# Altium project LED_Panel.PrjPCB (part 2 of 2)

## Sheet LEDs.SchDoc
size A3
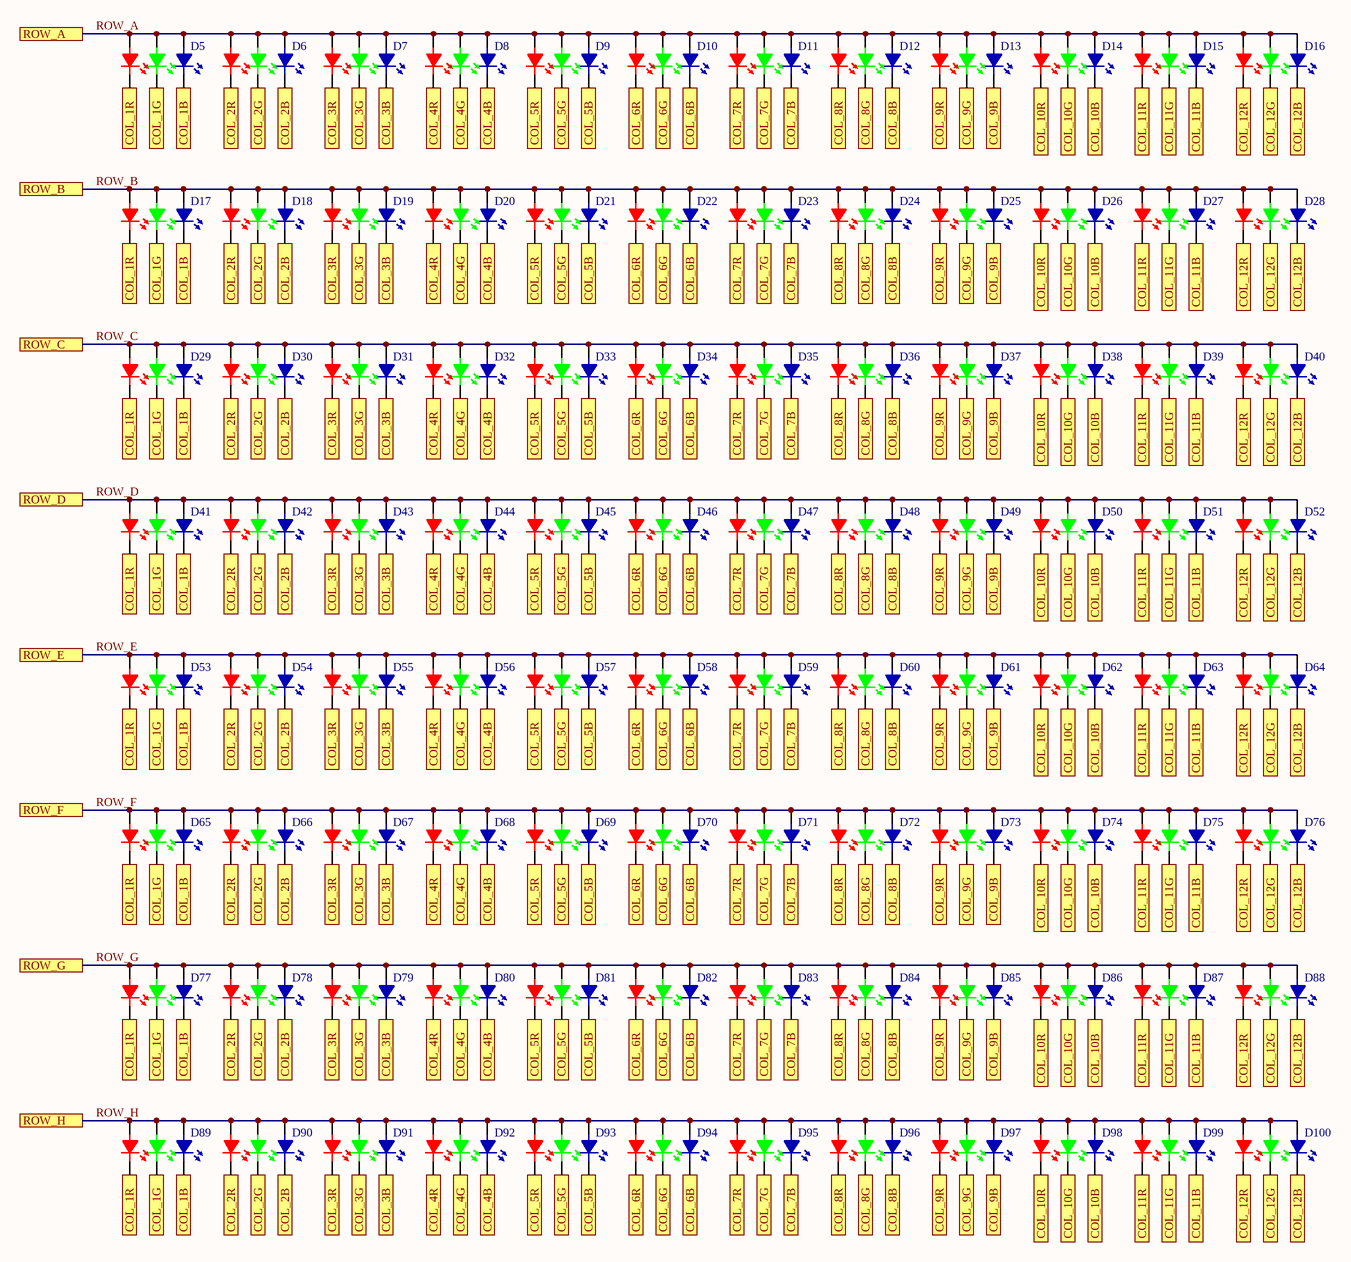
[diagram p2: LEDs.SchDoc]

### Parts
D5  CLX6E-FKC-CH1M1D1BB7C3D3  [LED_CLX6E]  (value not drawn)
D6  CLX6E-FKC-CH1M1D1BB7C3D3  [LED_CLX6E]  (value not drawn)
D7  CLX6E-FKC-CH1M1D1BB7C3D3  [LED_CLX6E]  (value not drawn)
D8  CLX6E-FKC-CH1M1D1BB7C3D3  [LED_CLX6E]  (value not drawn)
D9  CLX6E-FKC-CH1M1D1BB7C3D3  [LED_CLX6E]  (value not drawn)
D10  CLX6E-FKC-CH1M1D1BB7C3D3  [LED_CLX6E]  (value not drawn)
D11  CLX6E-FKC-CH1M1D1BB7C3D3  [LED_CLX6E]  (value not drawn)
D12  CLX6E-FKC-CH1M1D1BB7C3D3  [LED_CLX6E]  (value not drawn)
D13  CLX6E-FKC-CH1M1D1BB7C3D3  [LED_CLX6E]  (value not drawn)
D14  CLX6E-FKC-CH1M1D1BB7C3D3  [LED_CLX6E]  (value not drawn)
D15  CLX6E-FKC-CH1M1D1BB7C3D3  [LED_CLX6E]  (value not drawn)
D16  CLX6E-FKC-CH1M1D1BB7C3D3  [LED_CLX6E]  (value not drawn)
D17  CLX6E-FKC-CH1M1D1BB7C3D3  [LED_CLX6E]  (value not drawn)
D18  CLX6E-FKC-CH1M1D1BB7C3D3  [LED_CLX6E]  (value not drawn)
D19  CLX6E-FKC-CH1M1D1BB7C3D3  [LED_CLX6E]  (value not drawn)
D20  CLX6E-FKC-CH1M1D1BB7C3D3  [LED_CLX6E]  (value not drawn)
D21  CLX6E-FKC-CH1M1D1BB7C3D3  [LED_CLX6E]  (value not drawn)
D22  CLX6E-FKC-CH1M1D1BB7C3D3  [LED_CLX6E]  (value not drawn)
D23  CLX6E-FKC-CH1M1D1BB7C3D3  [LED_CLX6E]  (value not drawn)
D24  CLX6E-FKC-CH1M1D1BB7C3D3  [LED_CLX6E]  (value not drawn)
D25  CLX6E-FKC-CH1M1D1BB7C3D3  [LED_CLX6E]  (value not drawn)
D26  CLX6E-FKC-CH1M1D1BB7C3D3  [LED_CLX6E]  (value not drawn)
D27  CLX6E-FKC-CH1M1D1BB7C3D3  [LED_CLX6E]  (value not drawn)
D28  CLX6E-FKC-CH1M1D1BB7C3D3  [LED_CLX6E]  (value not drawn)
D29  CLX6E-FKC-CH1M1D1BB7C3D3  [LED_CLX6E]  (value not drawn)
D30  CLX6E-FKC-CH1M1D1BB7C3D3  [LED_CLX6E]  (value not drawn)
D31  CLX6E-FKC-CH1M1D1BB7C3D3  [LED_CLX6E]  (value not drawn)
D32  CLX6E-FKC-CH1M1D1BB7C3D3  [LED_CLX6E]  (value not drawn)
D33  CLX6E-FKC-CH1M1D1BB7C3D3  [LED_CLX6E]  (value not drawn)
D34  CLX6E-FKC-CH1M1D1BB7C3D3  [LED_CLX6E]  (value not drawn)
D35  CLX6E-FKC-CH1M1D1BB7C3D3  [LED_CLX6E]  (value not drawn)
D36  CLX6E-FKC-CH1M1D1BB7C3D3  [LED_CLX6E]  (value not drawn)
D37  CLX6E-FKC-CH1M1D1BB7C3D3  [LED_CLX6E]  (value not drawn)
D38  CLX6E-FKC-CH1M1D1BB7C3D3  [LED_CLX6E]  (value not drawn)
D39  CLX6E-FKC-CH1M1D1BB7C3D3  [LED_CLX6E]  (value not drawn)
D40  CLX6E-FKC-CH1M1D1BB7C3D3  [LED_CLX6E]  (value not drawn)
D41  CLX6E-FKC-CH1M1D1BB7C3D3  [LED_CLX6E]  (value not drawn)
D42  CLX6E-FKC-CH1M1D1BB7C3D3  [LED_CLX6E]  (value not drawn)
D43  CLX6E-FKC-CH1M1D1BB7C3D3  [LED_CLX6E]  (value not drawn)
D44  CLX6E-FKC-CH1M1D1BB7C3D3  [LED_CLX6E]  (value not drawn)
D45  CLX6E-FKC-CH1M1D1BB7C3D3  [LED_CLX6E]  (value not drawn)
D46  CLX6E-FKC-CH1M1D1BB7C3D3  [LED_CLX6E]  (value not drawn)
D47  CLX6E-FKC-CH1M1D1BB7C3D3  [LED_CLX6E]  (value not drawn)
D48  CLX6E-FKC-CH1M1D1BB7C3D3  [LED_CLX6E]  (value not drawn)
D49  CLX6E-FKC-CH1M1D1BB7C3D3  [LED_CLX6E]  (value not drawn)
D50  CLX6E-FKC-CH1M1D1BB7C3D3  [LED_CLX6E]  (value not drawn)
D51  CLX6E-FKC-CH1M1D1BB7C3D3  [LED_CLX6E]  (value not drawn)
D52  CLX6E-FKC-CH1M1D1BB7C3D3  [LED_CLX6E]  (value not drawn)
D53  CLX6E-FKC-CH1M1D1BB7C3D3  [LED_CLX6E]  (value not drawn)
D54  CLX6E-FKC-CH1M1D1BB7C3D3  [LED_CLX6E]  (value not drawn)
D55  CLX6E-FKC-CH1M1D1BB7C3D3  [LED_CLX6E]  (value not drawn)
D56  CLX6E-FKC-CH1M1D1BB7C3D3  [LED_CLX6E]  (value not drawn)
D57  CLX6E-FKC-CH1M1D1BB7C3D3  [LED_CLX6E]  (value not drawn)
D58  CLX6E-FKC-CH1M1D1BB7C3D3  [LED_CLX6E]  (value not drawn)
D59  CLX6E-FKC-CH1M1D1BB7C3D3  [LED_CLX6E]  (value not drawn)
D60  CLX6E-FKC-CH1M1D1BB7C3D3  [LED_CLX6E]  (value not drawn)
D61  CLX6E-FKC-CH1M1D1BB7C3D3  [LED_CLX6E]  (value not drawn)
D62  CLX6E-FKC-CH1M1D1BB7C3D3  [LED_CLX6E]  (value not drawn)
D63  CLX6E-FKC-CH1M1D1BB7C3D3  [LED_CLX6E]  (value not drawn)
D64  CLX6E-FKC-CH1M1D1BB7C3D3  [LED_CLX6E]  (value not drawn)
D65  CLX6E-FKC-CH1M1D1BB7C3D3  [LED_CLX6E]  (value not drawn)
D66  CLX6E-FKC-CH1M1D1BB7C3D3  [LED_CLX6E]  (value not drawn)
D67  CLX6E-FKC-CH1M1D1BB7C3D3  [LED_CLX6E]  (value not drawn)
D68  CLX6E-FKC-CH1M1D1BB7C3D3  [LED_CLX6E]  (value not drawn)
D69  CLX6E-FKC-CH1M1D1BB7C3D3  [LED_CLX6E]  (value not drawn)
D70  CLX6E-FKC-CH1M1D1BB7C3D3  [LED_CLX6E]  (value not drawn)
D71  CLX6E-FKC-CH1M1D1BB7C3D3  [LED_CLX6E]  (value not drawn)
D72  CLX6E-FKC-CH1M1D1BB7C3D3  [LED_CLX6E]  (value not drawn)
D73  CLX6E-FKC-CH1M1D1BB7C3D3  [LED_CLX6E]  (value not drawn)
D74  CLX6E-FKC-CH1M1D1BB7C3D3  [LED_CLX6E]  (value not drawn)
D75  CLX6E-FKC-CH1M1D1BB7C3D3  [LED_CLX6E]  (value not drawn)
D76  CLX6E-FKC-CH1M1D1BB7C3D3  [LED_CLX6E]  (value not drawn)
D77  CLX6E-FKC-CH1M1D1BB7C3D3  [LED_CLX6E]  (value not drawn)
D78  CLX6E-FKC-CH1M1D1BB7C3D3  [LED_CLX6E]  (value not drawn)
D79  CLX6E-FKC-CH1M1D1BB7C3D3  [LED_CLX6E]  (value not drawn)
D80  CLX6E-FKC-CH1M1D1BB7C3D3  [LED_CLX6E]  (value not drawn)
D81  CLX6E-FKC-CH1M1D1BB7C3D3  [LED_CLX6E]  (value not drawn)
D82  CLX6E-FKC-CH1M1D1BB7C3D3  [LED_CLX6E]  (value not drawn)
D83  CLX6E-FKC-CH1M1D1BB7C3D3  [LED_CLX6E]  (value not drawn)
D84  CLX6E-FKC-CH1M1D1BB7C3D3  [LED_CLX6E]  (value not drawn)
D85  CLX6E-FKC-CH1M1D1BB7C3D3  [LED_CLX6E]  (value not drawn)
D86  CLX6E-FKC-CH1M1D1BB7C3D3  [LED_CLX6E]  (value not drawn)
D87  CLX6E-FKC-CH1M1D1BB7C3D3  [LED_CLX6E]  (value not drawn)
D88  CLX6E-FKC-CH1M1D1BB7C3D3  [LED_CLX6E]  (value not drawn)
D89  CLX6E-FKC-CH1M1D1BB7C3D3  [LED_CLX6E]  (value not drawn)
D90  CLX6E-FKC-CH1M1D1BB7C3D3  [LED_CLX6E]  (value not drawn)
D91  CLX6E-FKC-CH1M1D1BB7C3D3  [LED_CLX6E]  (value not drawn)
D92  CLX6E-FKC-CH1M1D1BB7C3D3  [LED_CLX6E]  (value not drawn)
D93  CLX6E-FKC-CH1M1D1BB7C3D3  [LED_CLX6E]  (value not drawn)
D94  CLX6E-FKC-CH1M1D1BB7C3D3  [LED_CLX6E]  (value not drawn)
D95  CLX6E-FKC-CH1M1D1BB7C3D3  [LED_CLX6E]  (value not drawn)
D96  CLX6E-FKC-CH1M1D1BB7C3D3  [LED_CLX6E]  (value not drawn)
D97  CLX6E-FKC-CH1M1D1BB7C3D3  [LED_CLX6E]  (value not drawn)
D98  CLX6E-FKC-CH1M1D1BB7C3D3  [LED_CLX6E]  (value not drawn)
D99  CLX6E-FKC-CH1M1D1BB7C3D3  [LED_CLX6E]  (value not drawn)
D100  CLX6E-FKC-CH1M1D1BB7C3D3  [LED_CLX6E]  (value not drawn)

### Ports
COL_1B, COL_1G, COL_1R, COL_2B, COL_2G, COL_2R, COL_3B, COL_3G, COL_3R, COL_4B, COL_4G, COL_4R, COL_5B, COL_5G, COL_5R, COL_6B, COL_6G, COL_6R, COL_7B, COL_7G, COL_7R, COL_8B, COL_8G, COL_8R, COL_9B, COL_9G, COL_9R, COL_10B, COL_10G, COL_10R, COL_11B, COL_11G, COL_11R, COL_12B, COL_12G, COL_12R, ROW_A, ROW_B, ROW_C, ROW_D, ROW_E, ROW_F, ROW_G, ROW_H

### Nets
COL_1B: D5.1 D17.1 D29.1 D41.1 D53.1 D65.1 D77.1 D89.1 ; port COL_1B
COL_1G: D5.2 D17.2 D29.2 D41.2 D53.2 D65.2 D77.2 D89.2 ; port COL_1G
COL_1R: D5.3 D17.3 D29.3 D41.3 D53.3 D65.3 D77.3 D89.3 ; port COL_1R
COL_2B: D6.1 D18.1 D30.1 D42.1 D54.1 D66.1 D78.1 D90.1 ; port COL_2B
COL_2G: D6.2 D18.2 D30.2 D42.2 D54.2 D66.2 D78.2 D90.2 ; port COL_2G
COL_2R: D6.3 D18.3 D30.3 D42.3 D54.3 D66.3 D78.3 D90.3 ; port COL_2R
COL_3B: D7.1 D19.1 D31.1 D43.1 D55.1 D67.1 D79.1 D91.1 ; port COL_3B
COL_3G: D7.2 D19.2 D31.2 D43.2 D55.2 D67.2 D79.2 D91.2 ; port COL_3G
COL_3R: D7.3 D19.3 D31.3 D43.3 D55.3 D67.3 D79.3 D91.3 ; port COL_3R
COL_4B: D8.1 D20.1 D32.1 D44.1 D56.1 D68.1 D80.1 D92.1 ; port COL_4B
COL_4G: D8.2 D20.2 D32.2 D44.2 D56.2 D68.2 D80.2 D92.2 ; port COL_4G
COL_4R: D8.3 D20.3 D32.3 D44.3 D56.3 D68.3 D80.3 D92.3 ; port COL_4R
COL_5B: D9.1 D21.1 D33.1 D45.1 D57.1 D69.1 D81.1 D93.1 ; port COL_5B
COL_5G: D9.2 D21.2 D33.2 D45.2 D57.2 D69.2 D81.2 D93.2 ; port COL_5G
COL_5R: D9.3 D21.3 D33.3 D45.3 D57.3 D69.3 D81.3 D93.3 ; port COL_5R
COL_6B: D10.1 D22.1 D34.1 D46.1 D58.1 D70.1 D82.1 D94.1 ; port COL_6B
COL_6G: D10.2 D22.2 D34.2 D46.2 D58.2 D70.2 D82.2 D94.2 ; port COL_6G
COL_6R: D10.3 D22.3 D34.3 D46.3 D58.3 D70.3 D82.3 D94.3 ; port COL_6R
COL_7B: D11.1 D23.1 D35.1 D47.1 D59.1 D71.1 D83.1 D95.1 ; port COL_7B
COL_7G: D11.2 D23.2 D35.2 D47.2 D59.2 D71.2 D83.2 D95.2 ; port COL_7G
COL_7R: D11.3 D23.3 D35.3 D47.3 D59.3 D71.3 D83.3 D95.3 ; port COL_7R
COL_8B: D12.1 D24.1 D36.1 D48.1 D60.1 D72.1 D84.1 D96.1 ; port COL_8B
COL_8G: D12.2 D24.2 D36.2 D48.2 D60.2 D72.2 D84.2 D96.2 ; port COL_8G
COL_8R: D12.3 D24.3 D36.3 D48.3 D60.3 D72.3 D84.3 D96.3 ; port COL_8R
COL_9B: D13.1 D25.1 D37.1 D49.1 D61.1 D73.1 D85.1 D97.1 ; port COL_9B
COL_9G: D13.2 D25.2 D37.2 D49.2 D61.2 D73.2 D85.2 D97.2 ; port COL_9G
COL_9R: D13.3 D25.3 D37.3 D49.3 D61.3 D73.3 D85.3 D97.3 ; port COL_9R
COL_10B: D14.1 D26.1 D38.1 D50.1 D62.1 D74.1 D86.1 D98.1 ; port COL_10B
COL_10G: D14.2 D26.2 D38.2 D50.2 D62.2 D74.2 D86.2 D98.2 ; port COL_10G
COL_10R: D14.3 D26.3 D38.3 D50.3 D62.3 D74.3 D86.3 D98.3 ; port COL_10R
COL_11B: D15.1 D27.1 D39.1 D51.1 D63.1 D75.1 D87.1 D99.1 ; port COL_11B
COL_11G: D15.2 D27.2 D39.2 D51.2 D63.2 D75.2 D87.2 D99.2 ; port COL_11G
COL_11R: D15.3 D27.3 D39.3 D51.3 D63.3 D75.3 D87.3 D99.3 ; port COL_11R
COL_12B: D16.1 D28.1 D40.1 D52.1 D64.1 D76.1 D88.1 D100.1 ; port COL_12B
COL_12G: D16.2 D28.2 D40.2 D52.2 D64.2 D76.2 D88.2 D100.2 ; port COL_12G
COL_12R: D16.3 D28.3 D40.3 D52.3 D64.3 D76.3 D88.3 D100.3 ; port COL_12R
ROW_A: D5.4 D5.5 D5.6 D6.4 D6.5 D6.6 D7.4 D7.5 D7.6 D8.4 D8.5 D8.6 D9.4 D9.5 D9.6 D10.4 D10.5 D10.6 D11.4 D11.5 D11.6 D12.4 D12.5 D12.6 D13.4 D13.5 D13.6 D14.4 D14.5 D14.6 D15.4 D15.5 D15.6 D16.4 D16.5 D16.6 ; port ROW_A
ROW_B: D17.4 D17.5 D17.6 D18.4 D18.5 D18.6 D19.4 D19.5 D19.6 D20.4 D20.5 D20.6 D21.4 D21.5 D21.6 D22.4 D22.5 D22.6 D23.4 D23.5 D23.6 D24.4 D24.5 D24.6 D25.4 D25.5 D25.6 D26.4 D26.5 D26.6 D27.4 D27.5 D27.6 D28.4 D28.5 D28.6 ; port ROW_B
ROW_C: D29.4 D29.5 D29.6 D30.4 D30.5 D30.6 D31.4 D31.5 D31.6 D32.4 D32.5 D32.6 D33.4 D33.5 D33.6 D34.4 D34.5 D34.6 D35.4 D35.5 D35.6 D36.4 D36.5 D36.6 D37.4 D37.5 D37.6 D38.4 D38.5 D38.6 D39.4 D39.5 D39.6 D40.4 D40.5 D40.6 ; port ROW_C
ROW_D: D41.4 D41.5 D41.6 D42.4 D42.5 D42.6 D43.4 D43.5 D43.6 D44.4 D44.5 D44.6 D45.4 D45.5 D45.6 D46.4 D46.5 D46.6 D47.4 D47.5 D47.6 D48.4 D48.5 D48.6 D49.4 D49.5 D49.6 D50.4 D50.5 D50.6 D51.4 D51.5 D51.6 D52.4 D52.5 D52.6 ; port ROW_D
ROW_E: D53.4 D53.5 D53.6 D54.4 D54.5 D54.6 D55.4 D55.5 D55.6 D56.4 D56.5 D56.6 D57.4 D57.5 D57.6 D58.4 D58.5 D58.6 D59.4 D59.5 D59.6 D60.4 D60.5 D60.6 D61.4 D61.5 D61.6 D62.4 D62.5 D62.6 D63.4 D63.5 D63.6 D64.4 D64.5 D64.6 ; port ROW_E
ROW_F: D65.4 D65.5 D65.6 D66.4 D66.5 D66.6 D67.4 D67.5 D67.6 D68.4 D68.5 D68.6 D69.4 D69.5 D69.6 D70.4 D70.5 D70.6 D71.4 D71.5 D71.6 D72.4 D72.5 D72.6 D73.4 D73.5 D73.6 D74.4 D74.5 D74.6 D75.4 D75.5 D75.6 D76.4 D76.5 D76.6 ; port ROW_F
ROW_G: D77.4 D77.5 D77.6 D78.4 D78.5 D78.6 D79.4 D79.5 D79.6 D80.4 D80.5 D80.6 D81.4 D81.5 D81.6 D82.4 D82.5 D82.6 D83.4 D83.5 D83.6 D84.4 D84.5 D84.6 D85.4 D85.5 D85.6 D86.4 D86.5 D86.6 D87.4 D87.5 D87.6 D88.4 D88.5 D88.6 ; port ROW_G
ROW_H: D89.4 D89.5 D89.6 D90.4 D90.5 D90.6 D91.4 D91.5 D91.6 D92.4 D92.5 D92.6 D93.4 D93.5 D93.6 D94.4 D94.5 D94.6 D95.4 D95.5 D95.6 D96.4 D96.5 D96.6 D97.4 D97.5 D97.6 D98.4 D98.5 D98.6 D99.4 D99.5 D99.6 D100.4 D100.5 D100.6 ; port ROW_H

### Library data of the parts
D5-D100 = CLX6E-FKC-CH1M1D1BB7C3D3: LED RGB CLEAR 4SMD; Manufacturer: Cree; Color: Blue,Green,Red; Lens Color: Colorless; Luminous Intensity: 84mcd; Test Current: 10mA; Dominant Wavelength: 470nm; Forward Voltage: 3V; Lens Style: Flat,Square; Supplier 1: Digi-Key; Manufacturer Part Number: CLX6E-FKC-CH1M1D1BB7C3D3; Stock 1: 40797; Pricing 1: 1=0.19, 10=0.178, 100=0.165, 1000=0.14761 (USD); Mount: Surface Mount; Case/Package: SMD/SMT; Packaging: Tape and Reel; Lens Transparency: Clear; Length: 2mm; Height: 1mm; Width: 2mm; Supplier 2: Digi-Key; Stock 2: 1298; Pricing 2: 1=0.3, 10=0.282, 100=0.2606, 1000=0.23308 (USD); Supplier Part Number 1: CLX6E-FKC-CH1M1D1BB7C3D3CT-ND; ComponentLink1Description: Datasheet; ComponentLink1URL: https://www.cree.com/led-components/media/documents/ds-CLX6E-FKC-1359.pdf; ComponentLink2Description: Footprint (Page 12); ComponentLink2URL: https://www.cree.com/led-components/media/documents/sh-HB.pdf

## Nets that join several sheets
+3V3: LED_POWER (C15.2 R17.2 U6.5), LED_MCU (19 pins)
+5V: LED_POWER (5 pins), LED_MCU (16 pins)
GND: LED_POWER (17 pins), LED_MCU (18 pins)
BATT_LVL: LED_POWER (R20.1 R21.2), LED_MCU (U1.9)
CHG_DETECT: LED_POWER (R18.1 R19.2), LED_MCU (U1.8)
COL_1B: LED_MCU (U3.1), LEDs (8 pins)
COL_1G: LED_MCU (U3.44), LEDs (8 pins)
COL_1R: LED_MCU (U3.43), LEDs (8 pins)
COL_2B: LED_MCU (U3.4), LEDs (8 pins)
COL_2G: LED_MCU (U3.3), LEDs (8 pins)
COL_2R: LED_MCU (U3.2), LEDs (8 pins)
COL_3B: LED_MCU (U3.7), LEDs (8 pins)
COL_3G: LED_MCU (U3.6), LEDs (8 pins)
COL_3R: LED_MCU (U3.5), LEDs (8 pins)
COL_4B: LED_MCU (U3.10), LEDs (8 pins)
COL_4G: LED_MCU (U3.9), LEDs (8 pins)
COL_4R: LED_MCU (U3.8), LEDs (8 pins)
COL_5B: LED_MCU (U3.13), LEDs (8 pins)
COL_5G: LED_MCU (U3.12), LEDs (8 pins)
COL_5R: LED_MCU (U3.11), LEDs (8 pins)
COL_6B: LED_MCU (U3.16), LEDs (8 pins)
COL_6G: LED_MCU (U3.15), LEDs (8 pins)
COL_6R: LED_MCU (U3.14), LEDs (8 pins)
COL_7B: LED_MCU (U3.20), LEDs (8 pins)
COL_7G: LED_MCU (U3.19), LEDs (8 pins)
COL_7R: LED_MCU (U3.18), LEDs (8 pins)
COL_8B: LED_MCU (U3.23), LEDs (8 pins)
COL_8G: LED_MCU (U3.22), LEDs (8 pins)
COL_8R: LED_MCU (U3.21), LEDs (8 pins)
COL_9B: LED_MCU (U3.26), LEDs (8 pins)
COL_9G: LED_MCU (U3.25), LEDs (8 pins)
COL_9R: LED_MCU (U3.24), LEDs (8 pins)
COL_10B: LED_MCU (U3.29), LEDs (8 pins)
COL_10G: LED_MCU (U3.28), LEDs (8 pins)
COL_10R: LED_MCU (U3.27), LEDs (8 pins)
COL_11B: LED_MCU (U3.32), LEDs (8 pins)
COL_11G: LED_MCU (U3.31), LEDs (8 pins)
COL_11R: LED_MCU (U3.30), LEDs (8 pins)
COL_12B: LED_MCU (U3.35), LEDs (8 pins)
COL_12G: LED_MCU (U3.34), LEDs (8 pins)
COL_12R: LED_MCU (U3.33), LEDs (8 pins)
ROW_A: LED_MCU (Q1.3), LEDs (36 pins)
ROW_B: LED_MCU (Q3.3), LEDs (36 pins)
ROW_C: LED_MCU (Q5.3), LEDs (36 pins)
ROW_D: LED_MCU (Q6.3), LEDs (36 pins)
ROW_E: LED_MCU (Q8.3), LEDs (36 pins)
ROW_F: LED_MCU (Q9.3), LEDs (36 pins)
ROW_G: LED_MCU (Q11.3), LEDs (36 pins)
ROW_H: LED_MCU (Q12.3), LEDs (36 pins)